# EAGLE design hackstick-0.2 (EAGLE 5.11)
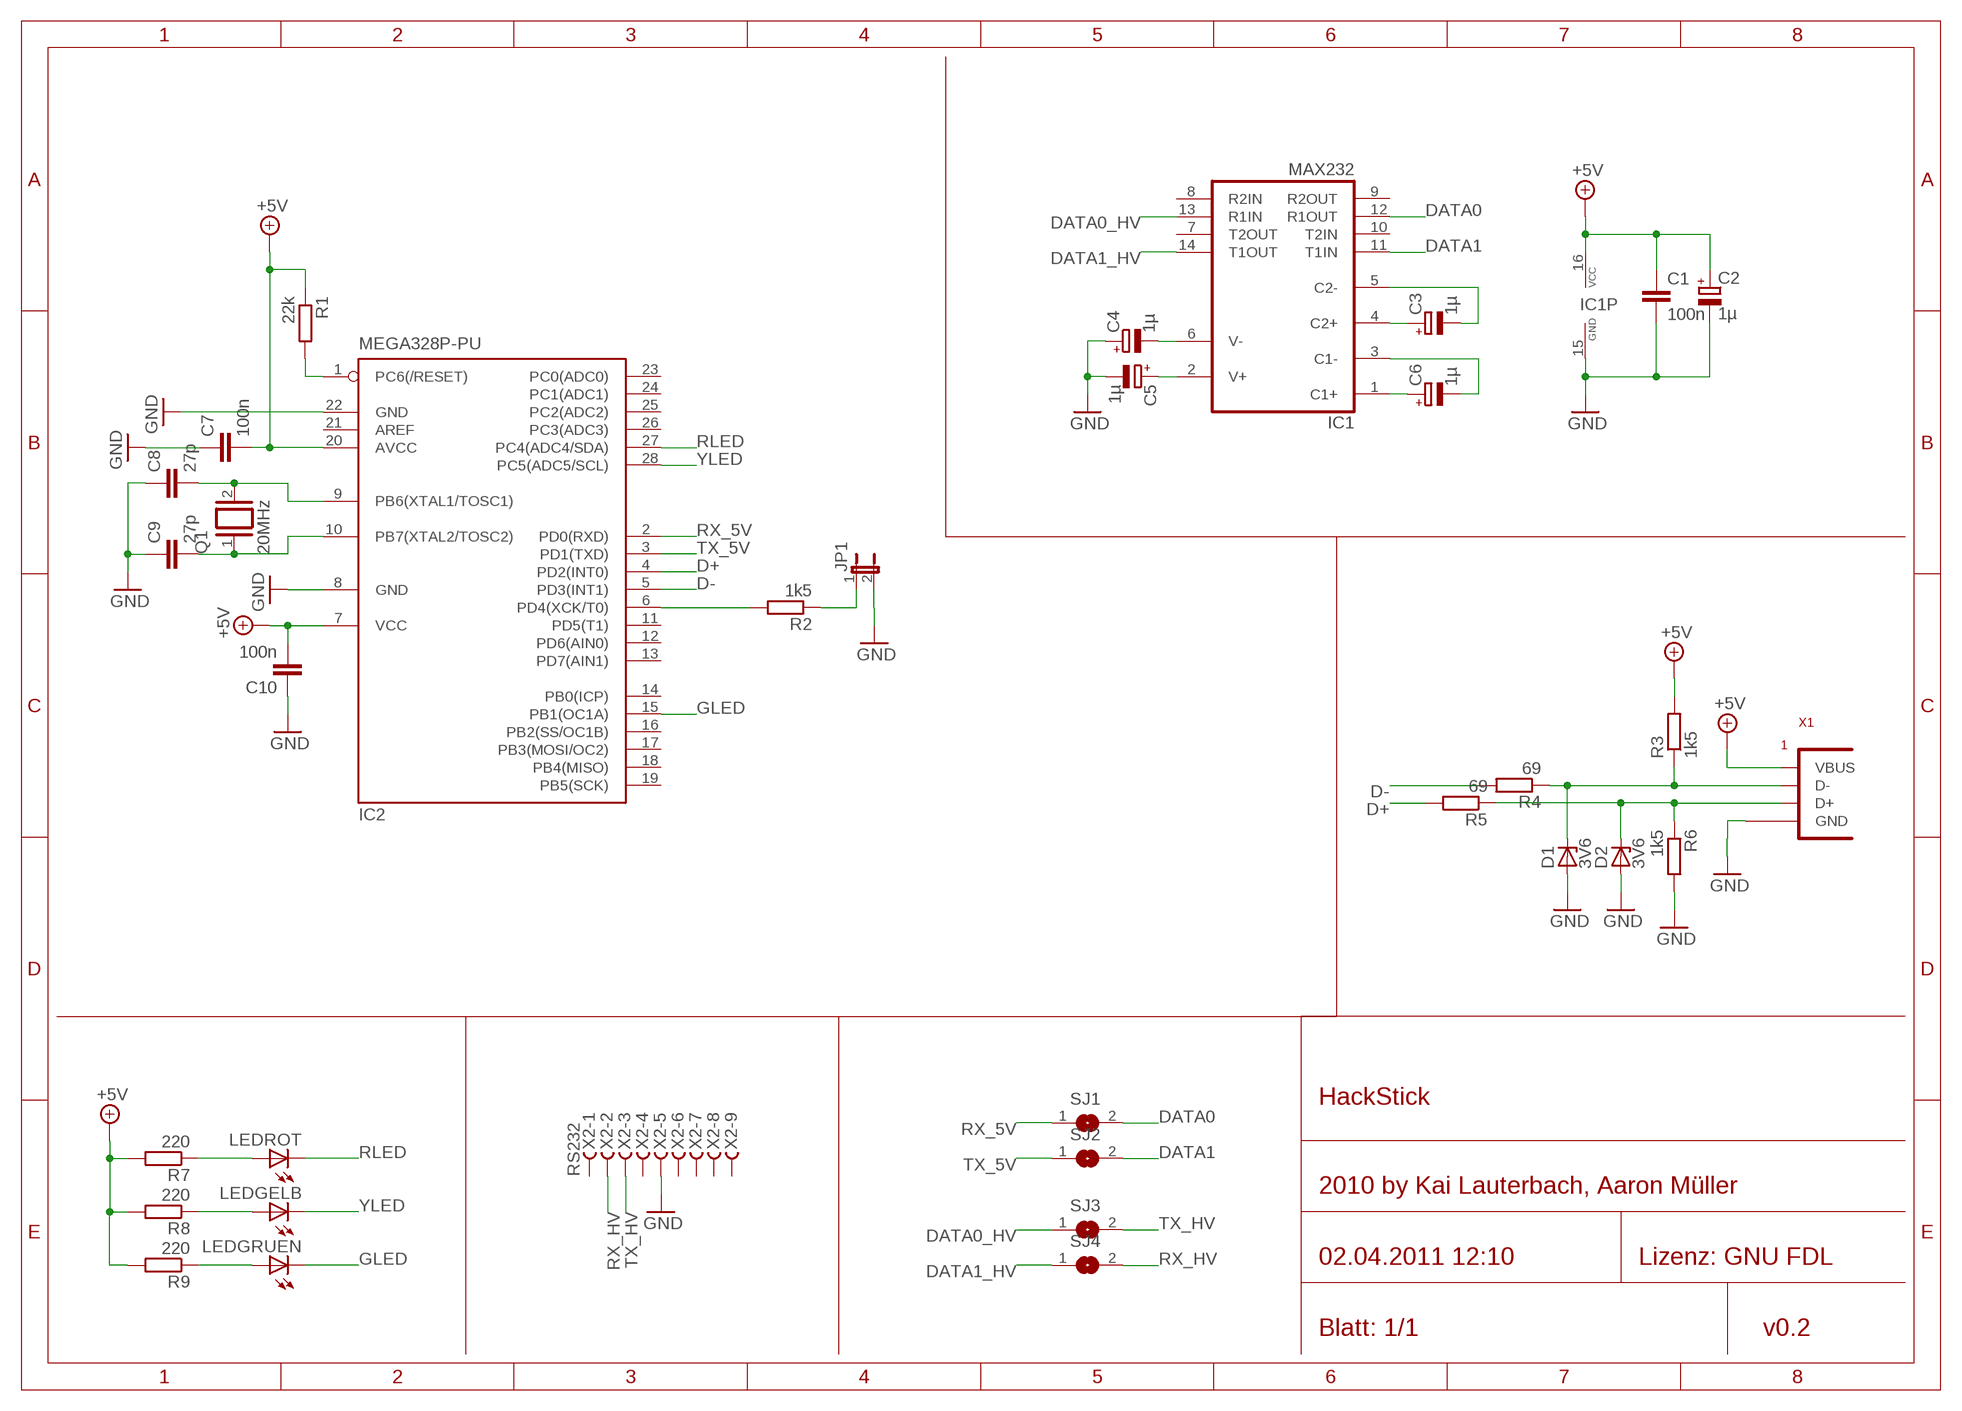
[diagram p0: schematic, sheet 1]

## Parts
C1  100n  C-EU025-024X044  [C025-024X044]
C2  1µ  CPOL-EUE2-5  [E2-5]
C3  1µ  CPOL-EUE2-5  [E2-5]
C4  1µ  CPOL-EUE2-5  [E2-5]
C5  1µ  CPOL-EUE2-5  [E2-5]
C6  1µ  CPOL-EUE2-5  [E2-5]
C7  100n  C-EU025-025X050  [C025-025X050]
C8  27p  C-EU025-024X044  [C025-024X044]
C9  27p  C-EU025-024X044  [C025-024X044]
C10  100n  C-EU025-025X050  [C025-025X050]
D1  3V6  ZENER-DIODEDO34-7  [DO34Z7]
D2  3V6  ZENER-DIODEDO34-7  [DO34Z7]
IC1  MAX232  [DIL16]
IC2  MEGA328P-PU  MEGA8-P  [DIL28-3]
JP1  JP1E  [JP1]
LEDGELB  LED3MM  [LED3MM]
LEDGRUEN  LED3MM  [LED3MM]
LEDROT  LED3MM  [LED3MM]
Q1  20MHz  XTAL/S  [QS]
R1  22k  R-EU_0207/2V  [0207/2V]
R2  1k5  R-EU_0207/2V  [0207/2V]
R3  1k5  R-EU_0207/2V  [0207/2V]
R4  69  R-EU_0207/2V  [0207/2V]
R5  69  R-EU_0207/2V  [0207/2V]
R6  1k5  R-EU_0207/2V  [0207/2V]
R7  220  R-EU_0207/2V  [0207/2V]
R8  220  R-EU_0207/2V  [0207/2V]
R9  220  R-EU_0207/2V  [0207/2V]
SJ1  SJ  [SJ]
SJ2  SJ  [SJ]
SJ3  SJ  [SJ]
SJ4  SJ  [SJ]
X1  USB_AWFDIP  [USB_AWF]
X2  RS232  D-SUB9-H3M09RA  [H3M09RA]

## Nets
+5V: C1.1 C2.+ C7.2 C10.2 IC1.16(VCC) IC2.7(VCC) IC2.20(AVCC) R1.1 R3.2 R7.2 R8.2 R9.2 X1.1(VBUS)
D+: IC2.4(PD2(INT0)) R5.2
D-: IC2.5(PD3(INT1)) R4.2
DATA0: IC1.12(R1OUT) SJ1.2
DATA0_HV: IC1.13(R1IN) SJ3.1
DATA1: IC1.11(T1IN) SJ2.2
DATA1_HV: IC1.14(T1OUT) SJ4.1
GLED: IC2.15(PB1(OC1A)) LEDGRUEN.K(C)
GND: C1.2 C2.- C4.+ C5.- C7.1 C8.1 C9.1 C10.1 D1.A D2.A IC1.15(GND) IC2.8(GND) IC2.22(GND) JP1.2 R6.2 X1.S1@1(GND) X2.5
N$1: C8.2 IC2.9(PB6(XTAL1/TOSC1)) Q1.2
N$2: C9.2 IC2.10(PB7(XTAL2/TOSC2)) Q1.1
N$3: C3.+ IC1.4(C2+)
N$4: C3.- IC1.5(C2-)
N$5: D2.C R5.1 R6.1 X1.3(D+)
N$6: D1.C R3.1 R4.1 X1.2(D-)
N$7: C6.- IC1.3(C1-)
N$8: C6.+ IC1.1(C1+)
N$9: C4.- IC1.6(V-)
N$10: C5.+ IC1.2(V+)
N$11: IC2.6(PD4(XCK/T0)) R2.2
N$21: LEDGRUEN.A R9.1
N$22: LEDROT.A R7.1
N$23: LEDGELB.A R8.1
N$31: JP1.1 R2.1
RESET: IC2.1(PC6(/RESET)) R1.2
RLED: IC2.27(PC4(ADC4/SDA)) LEDROT.K(C)
RX_5V: IC2.2(PD0(RXD)) SJ1.1
RX_HV: SJ4.2 X2.2
TX_5V: IC2.3(PD1(TXD)) SJ2.1
TX_HV: SJ3.2 X2.3
YLED: IC2.28(PC5(ADC5/SCL)) LEDGELB.K(C)
Unconnected: IC1.7(T2OUT) IC1.8(R2IN) IC1.9(R2OUT) IC1.10(T2IN) IC2.11(PD5(T1)) IC2.12(PD6(AIN0)) IC2.13(PD7(AIN1)) IC2.14(PB0(ICP)) IC2.16(PB2(SS/OC1B)) IC2.17(PB3(MOSI/OC2)) IC2.18(PB4(MISO)) IC2.19(PB5(SCK)) IC2.21(AREF) IC2.23(PC0(ADC0)) IC2.24(PC1(ADC1)) IC2.25(PC2(ADC2)) IC2.26(PC3(ADC3)) X2.1 X2.4 X2.6 X2.7 X2.8 X2.9

## Notes on the sheet
- HackStick
- 2010 by Kai Lauterbach, Aaron Müller
- 02.04.2011 12:10 | Lizenz: GNU FDL
- Blatt: 1/1 | v0.2

## Power pins joined to a net without a drawn wire
GND: X1.4(GND) X1.S1(GND)

## Library data of the parts
C1 C7-C10 = rcl:C-EU: CAPACITOR, European symbol
C2-C6 = rcl:CPOL-EU: POLARIZED CAPACITOR, European symbol
D1 D2 = diode:ZENER-DIODE: Z-Diode
IC1 = maxim:MAX232: RS232 TRANSEIVER
IC2 = atmel:MEGA8-P: MICROCONTROLLER 8 Kbytes FLASH, 1 kbytes SRAM, 512 bytes EEPROM, USART, 4-channel 10 bit ADC, 2-channel 8 bit ADC Pin compatible with Atmega48, ATMega88, ATMega168 Source: avr.lbr
JP1 = jumper:JP1E: JUMPER
LEDGELB LEDGRUEN LEDROT = led:LED: LED OSRAM: - CHIPLED LG R971, LG N971, LY N971, LG Q971, LY Q971, LO R971, LY R971 LH N974, LH R974 LS Q976, LO Q976, LY Q976 LO Q996 - Hyper CHIPLED LW Q18S LB Q993, LB Q99A, LB R99A - SideLED LS A670, LO A670, LY A670, LG A670, LP A670 LB A673, LV A673, LT A673, LW A673 LH A674 LY A675 LS A676, LA A676, LO A676, LY A676, LW A676 LS A679, LY A679, LG A679 - Hyper Micro SIDELED® LS Y876, LA Y876, LO Y876, LY Y876 LT Y87S - SmartLED LW L88C, LW L88S LB L89C, LB L89S, LG L890 LS L89K, LO L89K, LY L89K LS L896, LA L896, LO L896, LY L896 - TOPLED LS T670, LO T670, LY T670, LG T670, LP T670 LSG T670, LSP T670, LSY T670, LOP T670, LYG T670 LG T671, LOG T671, LSG T671 LB T673, LV T673, LT T673, LW T673 LH T674 LS T676, LA T676, LO T676, LY T676, LB T676, LH T676, LSB T676, LW T676 LB T67C, LV T67C, LT T67C, LS T67K, LO T67K, LY T67K, LW E67C LS E67B, LA E67B, LO E67B, LY E67B, LB E67C, LV E67C, LT E67C LW T67C LS T679, LY T679, LG T679 LS T770, LO T770, LY T770, LG T770, LP T770 LB T773, LV T773, LT T773, LW T773 LH T774 LS E675, LA E675, LY E675, LS T675 LS T776, LA T776, LO T776, LY T776, LB T776 LHGB T686 LT T68C, LB T68C - Hyper Mini TOPLED® LB M676 - Mini TOPLED Santana® LG M470 LS M47K, LO M47K, LY M47K Source: http://www.osram.convergy.de LUXEON: - LUMILED® LXK2-PW12-R00, LXK2-PW12-S00, LXK2-PW14-U00, LXK2-PW14-V00 LXK2-PM12-R00, LXK2-PM12-S00, LXK2-PM14-U00 LXK2-PE12-Q00, LXK2-PE12-R00, LXK2-PE12-S00, LXK2-PE14-T00, LXK2-PE14-U00 LXK2-PB12-K00, LXK2-PB12-L00, LXK2-PB12-M00, LXK2-PB14-N00, LXK2-PB14-P00, LXK2-PB14-Q00 LXK2-PR12-L00, LXK2-PR12-M00, LXK2-PR14-Q00, LXK2-PR14-R00 LXK2-PD12-Q00, LXK2-PD12-R00, LXK2-PD12-S00 LXK2-PH12-R00, LXK2-PH12-S00 LXK2-PL12-P00, LXK2-PL12-Q00, LXK2-PL12-R00 Source: www.luxeon.com KINGBRIGHT: KA-3528ASYC Source: www.kingbright.com
Q1 = special:XTAL/S: CRYSTAL
R1-R9 = rcl:R-EU_: RESISTOR, European symbol
SJ1-SJ4 = jumper:SJ: SMD solder JUMPER
X1 = reichelt_usb:USB_AWF
X2 = con-thomas-betts:D-SUB9-: D-Subminiatur Connector Source: Electronioc Interconnects European Edition 1998

## Board
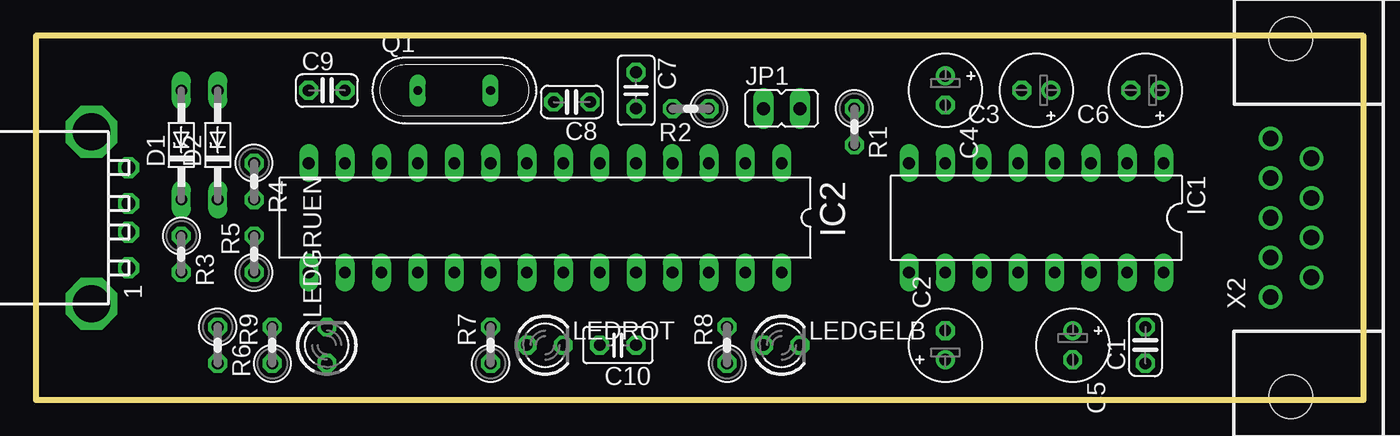
[diagram p1: board, top side]
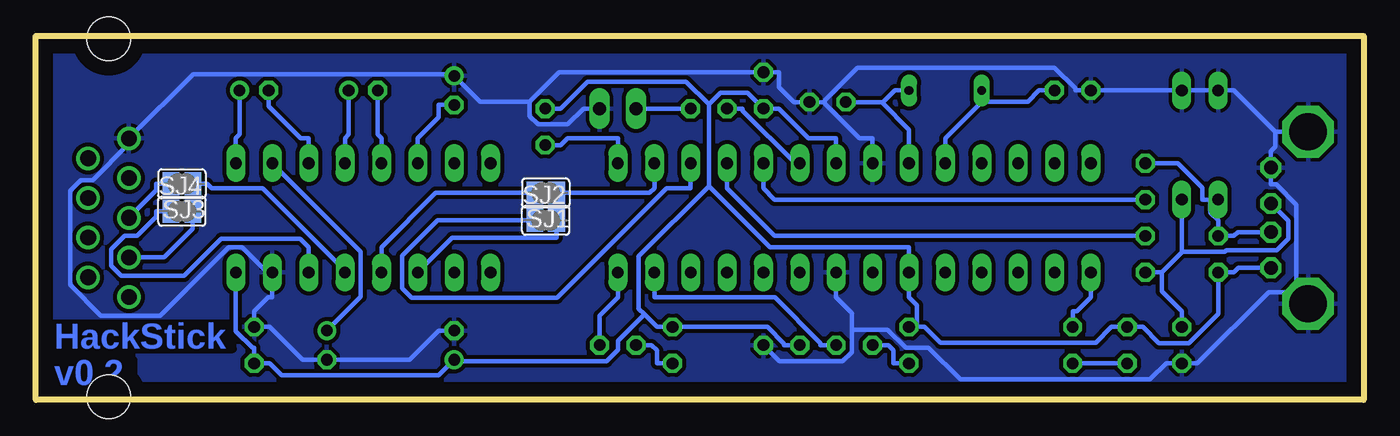
[diagram p2: board, bottom side, seen from below]

Size 92.71 x 25.4 mm. Coordinates in mm from the lower left corner, seen from the top.
Outline: 0,25.4 0,0 92.71,0 92.71,25.4 0,25.4
Copper layers (1*16): Top 0.035mm / dielectric 1.5mm / Bottom 0.035mm
Design rules "default *": minimum track width 12mil, minimum drill 24mil, track to track 11mil, track to pad 11mil, pad to pad 10mil, via to via 8mil, smd to smd 8mil, copper to edge 40mil, drill to drill 8mil, minimum pad ring 10mil, minimum via ring 8mil, stop-mask expansion 4mil, vias tented up to drill 0mil, thermal gap 10mil

### Footprints (pad centres in the part's own frame; a part is rotated, then mirrored left to right if it is on the bottom)
C025-024X044 = drill 0.813 octagon: 1 -1.27,0; 2 1.27,0
E2-5 = drill 0.813 pad 1.27 round: + -1.016,0 | drill 0.813 pad 1.27 octagon: - 1.016,0
C025-025X050 = drill 0.813 octagon: 1 -1.27,0; 2 1.27,0
DO34Z7 = drill 0.813 long: A 3.81,0; C -3.81,0
DIL16 = drill 0.813 long: 1 -8.89,-3.81; 2 -6.35,-3.81; 3 -3.81,-3.81; 4 -1.27,-3.81; 5 1.27,-3.81; 6 3.81,-3.81; 7 6.35,-3.81; 8 8.89,-3.81; 9 8.89,3.81; 10 6.35,3.81; 11 3.81,3.81; 12 1.27,3.81; 13 -1.27,3.81; 14 -3.81,3.81; 15 -6.35,3.81; 16 -8.89,3.81
DIL28-3 = drill 0.813 long: 1 -16.51,-3.81; 2 -13.97,-3.81; 3 -11.43,-3.81; 4 -8.89,-3.81; 5 -6.35,-3.81; 6 -3.81,-3.81; 7 -1.27,-3.81; 8 1.27,-3.81; 9 3.81,-3.81; 10 6.35,-3.81; 11 8.89,-3.81; 12 11.43,-3.81; 13 13.97,-3.81; 14 16.51,-3.81; 15 16.51,3.81; 16 13.97,3.81; 17 11.43,3.81; 18 8.89,3.81; 19 6.35,3.81; 20 3.81,3.81; 21 1.27,3.81; 22 -1.27,3.81; 23 -3.81,3.81; 24 -6.35,3.81; 25 -8.89,3.81; 26 -11.43,3.81; 27 -13.97,3.81; 28 -16.51,3.81
JP1 = drill 0.914 long: 1 0,-1.27; 2 0,1.27
LED3MM = drill 0.813 octagon: A -1.27,0; K 1.27,0
QS = drill 0.61 long: 1 -2.54,0; 2 2.54,0
0207/2V = drill 0.813 octagon: 1 -1.27,0; 2 1.27,0
SJ = smd 1.168 x 1.6: 1 -0.762,0; 2 0.762,0
USB_AWF = drill 0.95 octagon: 1 3.5,1.4; 2 1,1.4; 3 -1,1.4; 4 -3.5,1.4 | drill 2.6 pad 3.2 octagon: S1 6,-1.2; S1@1 -6,-1.2
H3M09RA = drill 1.092 round: 1 -5.537,1.422; 2 -2.769,1.422; 3 0,1.422; 4 2.769,1.422; 5 5.537,1.422; 6 -4.153,-1.422; 7 -1.384,-1.422; 8 1.384,-1.422; 9 4.153,-1.422 | hole 3.048: -12.497,0; 12.497,0

### Placement (x,y rotation side)
C1  77.47,3.81 90 top
C2  63.5,3.81 90 top
C3  69.85,21.59 180 top
C4  63.5,21.59 270 top
C5  72.39,3.81 270 top
C6  77.47,21.59 180 top
C7  41.91,21.59 270 top
C8  37.42,20.78 180 top
C9  20.32,21.59 0 top
C10  40.64,3.81 180 top
D1  10.16,17.78 90 top
D2  12.7,17.78 90 top
IC1  69.85,12.7 180 top
IC2  35.56,12.7 180 top
JP1  52.07,20.32 270 top
LEDGELB  52.07,3.81 0 top
LEDGRUEN  20.32,3.81 90 top
LEDROT  35.56,3.81 0 top
Q1  29.21,21.59 0 top
R1  57.15,19.05 270 top
R2  45.72,20.32 180 top
R3  10.16,10.16 270 top
R4  15.24,15.24 270 top
R5  15.24,10.16 90 top
R6  12.7,3.81 270 top
R7  31.75,3.81 90 top
R8  48.26,3.81 90 top
R9  16.51,3.81 90 top
SJ1  57.11,14.43 180 bottom
SJ2  57.11,12.53 0 bottom
SJ3  82.51,15.07 180 bottom
SJ4  82.51,13.16 0 bottom
X1  5.08,12.7 270 top
X2  87.63,12.7 90 top

### Tracks (layer width: path | path; a pad name or v marks a point on that pad's centre or on a via)
+5V
  Bottom 0.305: 45.72,20.61 44.89,21.44 43.03,21.44 C7.2 40.82,20.32 38.76,18.26 36.83,18.26 IC2.7 | 45.72,14.91 45.72,20.61 | 45.72,20.61 47.31,22.2 54.18,22.2 56.06,20.32 R1.1 | 50.22,5.95 50.63,6.36 50.63,10 45.72,14.91 | 45.72,14.91 41.45,10.64 31.75,10.64 IC2.20 31.75,7.14 31.2,6.59 31.2,5.08 | 31.2,5.08 30.66,5.08 29.56,3.98 18.71,3.98 17.6,5.08 17.06,5.08 R9.2 15.42,5.08 14.29,3.96 12.2,3.96 10.16,6 R3.2 9.07,8.89 8.76,9.2 X1.1 | 31.2,5.08 R7.2 | 50.22,5.95 52.07,4.11 52.07,3.47 52.87,2.68 63.38,2.68 C2.+ 64.59,1.7 75.54,1.7 76.38,2.54 C1.1 77.47,3.63 77.58,3.63 78.74,4.79 IC1.16 | 50.22,5.95 49.35,5.08 R8.2 41.62,5.08 40.46,3.92 40.46,3.81 C10.2
D+
  Bottom 0.305: IC2.4 44.45,14.76 41.12,11.43 R5.2
D-
  Bottom 0.305: IC2.5 41.91,14.76 41.12,13.97 R4.2
DATA0
  Bottom 0.305: IC1.12 68.58,10.64 64.79,14.43 SJ1.2
DATA0_HV
  Bottom 0.305: SJ3.1 80.73,15.07 80.42,14.76 76.88,14.76 71.12,9 IC1.13
DATA1
  Bottom 0.305: SJ2.2 56.35,11.29 63.64,11.29 IC1.11
DATA1_HV
  Bottom 0.305: IC1.14 73.66,10.64 74.24,11.23 79.78,11.23 82.36,8.65 86.75,8.65 87.46,9.36 87.46,10.51 86.52,11.45 85.62,11.45 84.29,12.78 84.29,13.16 SJ4.1
GLED
  Bottom 0.305: LEDGRUEN.K 20.32,6.17 20.02,6.17 19.05,7.14 IC2.15
GND
  Bottom 0.305: 76.2,8.55 78.29,10.64 79.25,10.64 84.01,5.88 88.17,5.88 90.32,8.03 90.32,14.58 89.57,15.34 88.74,15.34 86.21,17.87 X2.5 81.72,22.72 63.61,22.72 C4.+ 61.68,20.79 58.24,20.79 | 76.2,8.55 IC1.15 | 76.2,8.55 76.2,8.52 76.2,7.14 76.5,7.14 77.47,6.17 C1.2 76.38,5.08 74.09,2.79 C5.- 66.62,2.79 64.59,4.83 C2.- | 58.24,20.79 56.17,22.86 C7.1 40.82,22.86 40.82,21.81 39.79,20.78 C8.1 37.6,20.78 | 37.6,20.78 37.6,20.91 35.33,23.18 21.6,23.18 20.14,21.73 20.14,21.59 C9.1 D2.A D1.A 9.07,21.59 6.18,18.7 | IC2.8 34.29,18.26 35.2,18.26 37.6,20.67 37.6,20.78 | 4.7,7.52 6.63,7.52 11.61,2.54 R6.2 13.79,2.54 14.92,1.41 28.16,1.41 30.38,3.63 31.97,3.63 33.24,4.9 35.74,4.9 | X1.S1 4.7,7.52 | 4.7,7.52 4.7,13.62 6.12,15.04 6.48,15.04 X1.4 6.48,17.36 6.18,17.66 6.18,18.7 | 35.74,4.9 35.74,6.04 36.83,7.14 IC2.22 | C10.1 40.77,2.67 36.39,2.67 35.74,3.33 35.74,4.9 | 58.24,20.79 58.24,19.8 57.65,19.21 55.59,19.21 54.48,20.32 JP1.2 | 6.18,18.7 5,18.7 X1.S1@1
  pour Bottom: 0,25.4 92.71,25.4 92.71,0 0,0
N$1
  Bottom 0.305: 33.62,20.71 33.68,20.78 35.06,20.78 C8.2 | IC2.9 31.75,18.85 33.62,20.71 | 33.62,20.71 32.74,21.59 Q1.2
N$2
  Bottom 0.305: 26.67,20.82 26.67,20.8 29.21,18.26 IC2.10 | 26.67,20.82 23.46,20.82 22.68,21.59 C9.2 | 26.67,20.82 Q1.1
N$3
  Bottom 0.305: IC1.4 71.12,18.26 70.87,18.52 C3.+
N$4
  Bottom 0.305: IC1.5 68.58,18.26 68.83,18.52 C3.-
N$5
  Bottom 0.305: 12.7,10.34 12.7,10.29 14.1,8.89 | 12.7,10.34 D2.C | X1.3 5.28,12.5 5.28,11.22 6.05,10.45 9.59,10.45 9.71,10.34 12.7,10.34 | 14.1,8.89 14.1,7.57 12.7,6.17 R6.1 | 14.1,8.89 14.15,8.89 R5.1
N$6
  Bottom 0.305: 10.71,13.97 10.71,13.07 10.16,12.52 R3.1 9.07,11.43 8.8,11.7 X1.2 | 10.71,13.97 11.25,13.97 11.25,14.79 12.97,16.51 R4.1 | 10.71,13.97 D1.C
N$7
  Bottom 0.305: IC1.3 73.66,18.26 74.22,18.26 76.45,20.5 C6.-
N$8
  Bottom 0.305: IC1.1 78.74,18.26 78.49,18.52 C6.+
N$9
  Bottom 0.305: C4.- 64.59,20.57 64.59,19.71 66.04,18.26 IC1.6
N$10
  Bottom 0.305: IC1.2 70.02,10.33 70.02,7.19 C5.+
N$11
  Bottom 0.305: R2.2 43.36,20.32 43.36,20.18 39.68,16.51 IC2.6
N$21
  Bottom 0.305: R9.1 LEDGRUEN.A
N$22
  Bottom 0.305: R7.1 32.84,2.54 32.84,3.45 33.2,3.81 LEDROT.A
N$23
  Bottom 0.305: R8.1 49.35,2.54 49.35,3.45 49.71,3.81 LEDGELB.A
N$31
  Bottom 0.305: R2.1 JP1.1
RESET
  Bottom 0.305: R1.2 56.06,17.78 55.57,18.26 52.07,18.26 IC2.1
RLED
  Bottom 0.305: IC2.27 49.53,7.14 41.11,7.14 37.92,3.95 37.92,3.81 LEDROT.K
RX_5V
  Bottom 0.305: IC2.2 49.53,14.76 49.86,14.43 SJ1.1
RX_HV
  Bottom 0.305: X2.2 83.75,9.93 81.75,11.93 SJ4.2
TX_5V
  Bottom 0.305: IC2.3 46.99,14.76 48.67,14.76 56.31,7.12 66.47,7.12 67.15,7.79 67.15,10.04 64.67,12.53 SJ2.1
TX_HV
  Bottom 0.305: SJ3.2 84.29,15.07 84.29,14.62 X2.3
YLED
  Bottom 0.305: IC2.28 52.07,7.14 53.34,5.87 LEDGELB.K

### Text on the board
Bottom: HackStick | v0.2